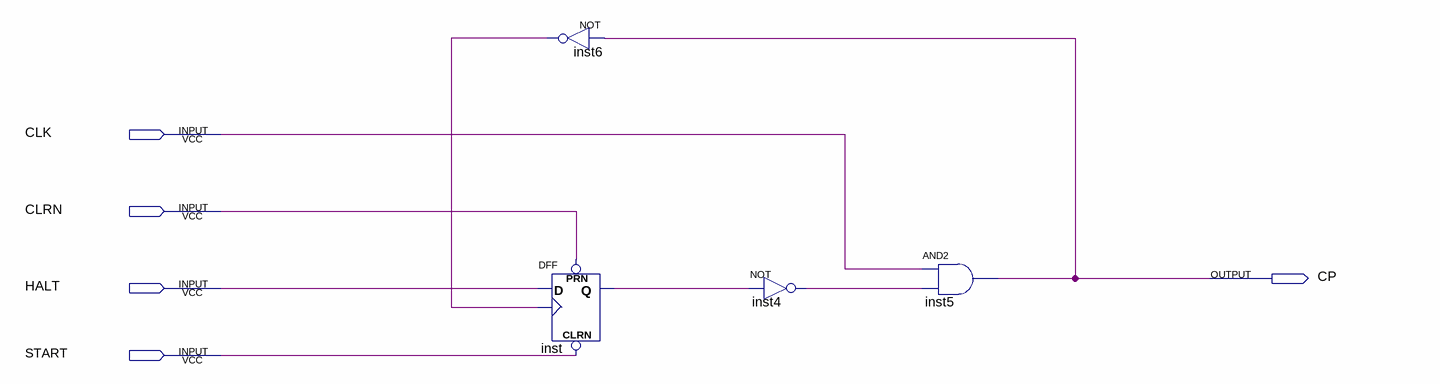
[diagram p0: schematic sheet]
// Quartus schematic HALT.bdf as structural Verilog: 4 symbols, 5 pins
module HALT (
  input  CLK,
  input  CLRN,
  input  HALT,
  input  START,
  output CP
);

  wire inst4_out, inst6_out, inst_q;

  not inst6 (inst6_out, CP);
  DFF inst (.CLRN(START), .CLK(inst6_out), .D(HALT), .PRN(CLRN), .Q(inst_q));
  not inst4 (inst4_out, inst_q);
  and inst5 (CP, CLK, inst4_out);
endmodule
